# EAGLE schematic Schem (EAGLE 6.2)
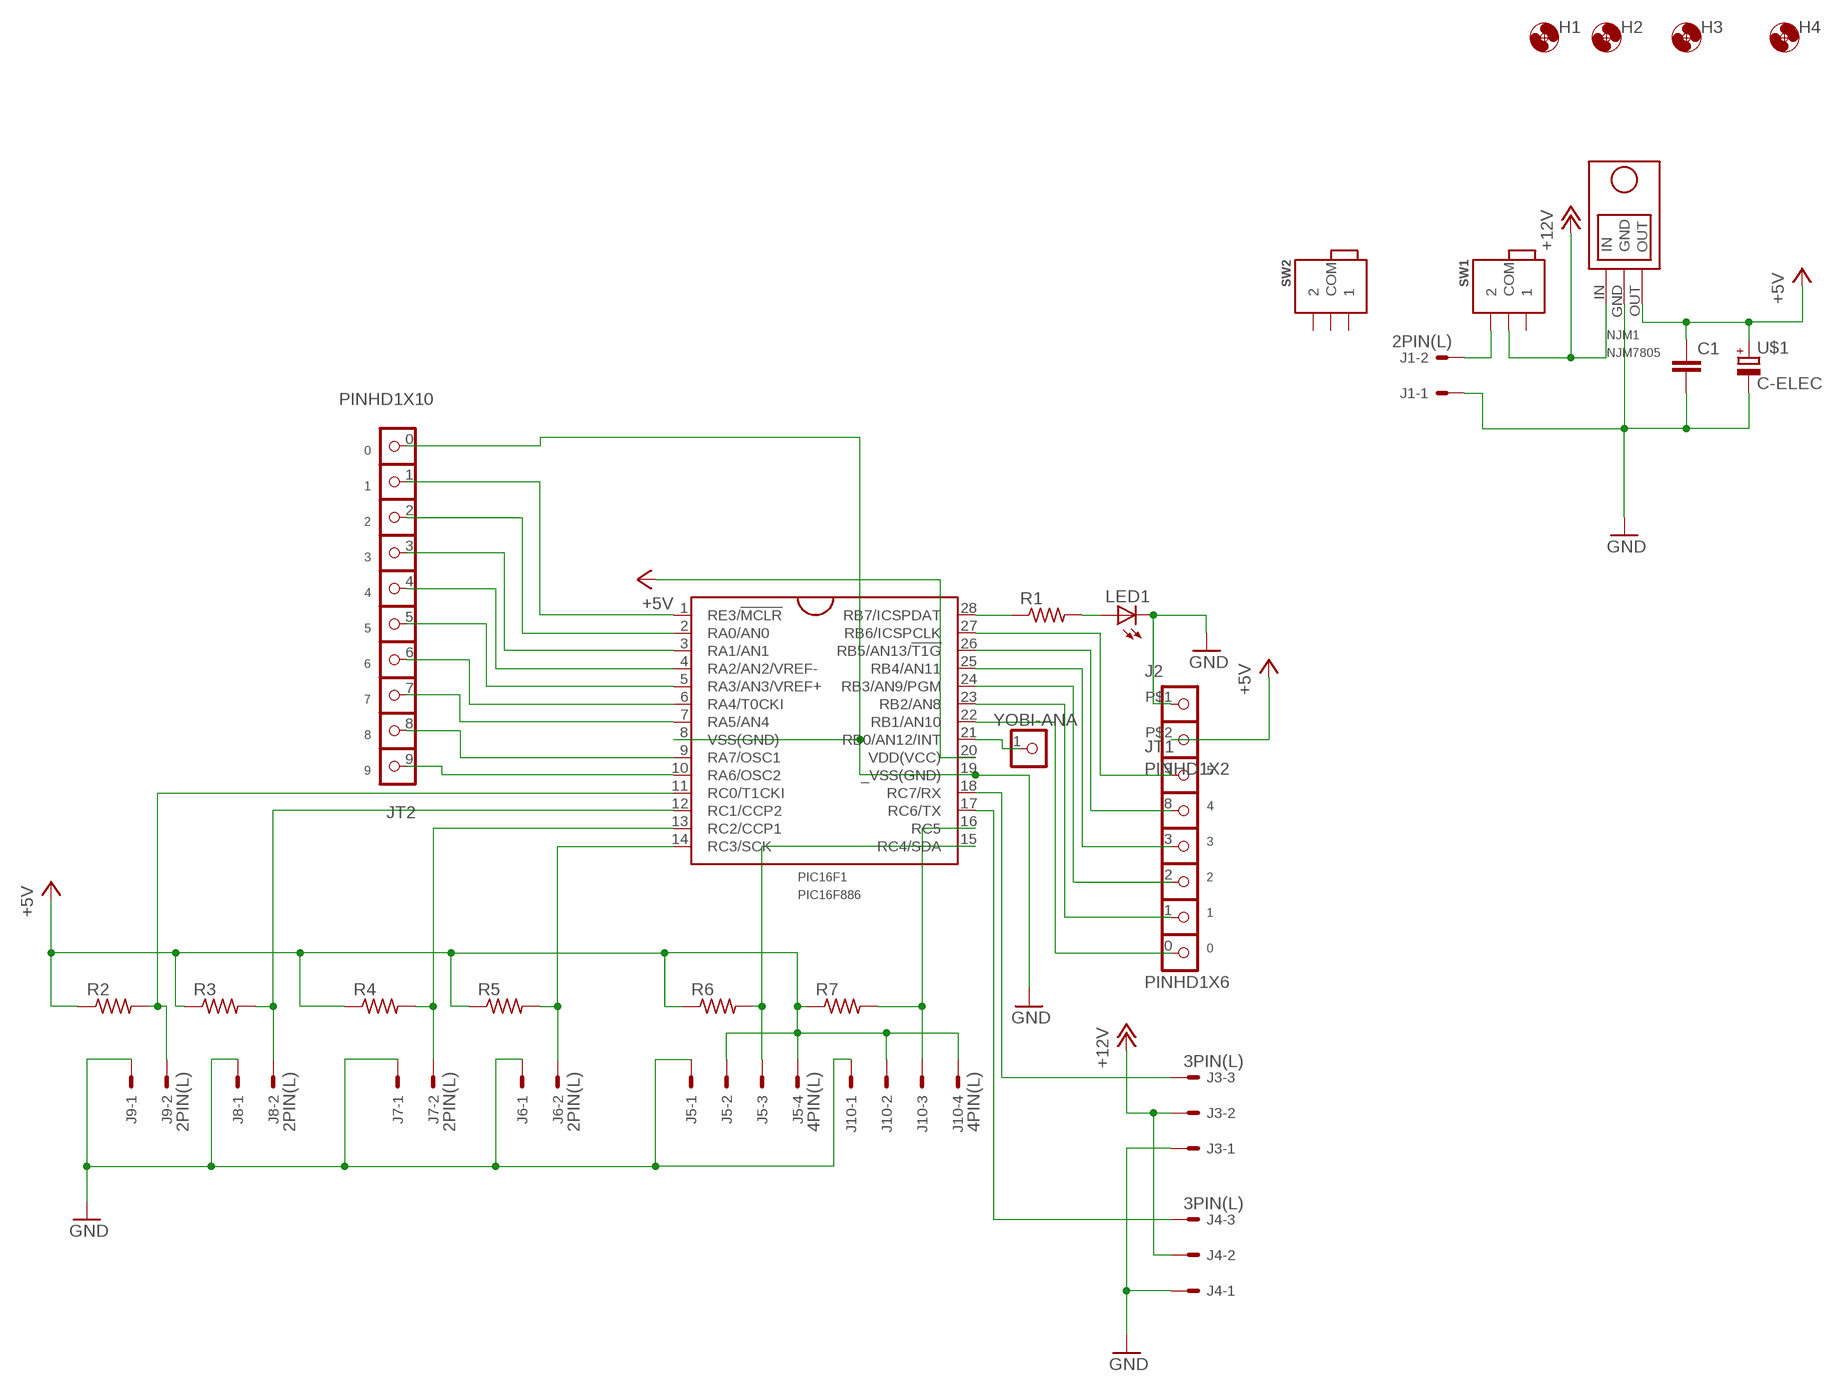
[diagram p0: schematic, sheet 1]

## Parts
C1  C-  [C-2.54]
H1  HOLE3.3M3BOLT  [HOLE3.3]
H2  HOLE3.3M3BOLT  [HOLE3.3]
H3  HOLE3.3M3BOLT  [HOLE3.3]
H4  HOLE3.3M3BOLT  [HOLE3.3]
J1  2PIN(L)  [2PL]
J2  PINHD1X2  [PINHD1X2]
J3  3PIN(L)  [3PL]
J4  3PIN(L)  [3PL]
J5  4PIN(L)  [4PL]
J6  2PIN(L)  [2PL]
J7  2PIN(L)  [2PL]
J8  2PIN(L)  [2PL]
J9  2PIN(L)  [2PL]
J10  4PIN(L)  [4PL]
JT1  PINHD1X6  [PINHD1X6]
JT2  PINHD1X10  [PINHD1X10]
LED1  LED  [LED5MM]
NJM1  NJM7805  [NJM7805]
PIC16F1  PIC16F886  [DIL28-3]
R1  R-  [0207/10]
R2  R-  [0207/10]
R3  R-  [0207/10]
R4  R-  [0207/10]
R5  R-  [0207/10]
R6  R-  [0207/10]
R7  R-  [0207/10]
SW1  SWITCH_MINI  [SWITCH_MINI]
SW2  SWITCH_MINI  [SWITCH_MINI]
U$1  C-ELEC  [C-6MM]
YOBI-ANA  PINHD-1X1SMALL  [1X01_SMALL]

## Nets
+5V: C1.P$1 J2.P$2 J5.2 J5.4 J10.2 J10.4 NJM1.OUT PIC16F1.20(VDD(VCC)) R2.1 R3.1 R4.1 R5.1 R6.1 R7.1 U$1.+
+12V: J3.2 J4.2 NJM1.IN SW1.COM
GND: C1.P$2 J1.1 J2.P$1 J3.1 J4.1 J5.1 J6.1 J7.1 J8.1 J9.1 J10.1 JT2.0 LED1.K(C) NJM1.GND PIC16F1.8(VSS(GND)) PIC16F1.19(_VSS(GND)) U$1.-
N$1: JT1.9 PIC16F1.27(RB6/ICSPCLK)
N$2: JT1.8 PIC16F1.26(RB5/AN13/!T1G)
N$3: JT1.3 PIC16F1.25(RB4/AN11)
N$4: JT1.2 PIC16F1.24(RB3/AN9/PGM)
N$5: JT1.1 PIC16F1.23(RB2/AN8)
N$6: PIC16F1.28(RB7/ICSPDAT) R1.1
N$7: LED1.A R1.2
N$8: JT1.0 PIC16F1.22(RB1/AN10)
N$9: J4.3 PIC16F1.17(RC6/TX)
N$10: J3.3 PIC16F1.18(RC7/RX)
N$11: J9.2 PIC16F1.11(RC0/T1CKI) R2.2
N$12: J1.2 SW1.2
N$13: J7.2 PIC16F1.13(RC2/CCP1) R4.2
N$14: J6.2 PIC16F1.14(RC3/SCK) R5.2
N$15: J8.2 PIC16F1.12(RC1/CCP2) R3.2
N$16: J5.3 PIC16F1.15(RC4/SDA) R6.2
N$17: PIC16F1.21(RB0/AN12/INT) YOBI-ANA.1
N$19: JT2.9 PIC16F1.10(RA6/OSC2)
N$20: JT2.8 PIC16F1.9(RA7/OSC1)
N$21: JT2.7 PIC16F1.7(RA5/AN4)
N$22: JT2.6 PIC16F1.6(RA4/T0CKI)
N$23: JT2.5 PIC16F1.5(RA3/AN3/VREF+)
N$24: JT2.4 PIC16F1.4(RA2/AN2/VREF-)
N$25: JT2.3 PIC16F1.3(RA1/AN1)
N$26: JT2.2 PIC16F1.2(RA0/AN0)
N$27: JT2.1 PIC16F1.1(RE3/!MCLR)
N$28: J10.3 PIC16F1.16(RC5) R7.2
Unconnected: SW1.1 SW2.1 SW2.2 SW2.COM

## Library data of the parts
C1 = My_rcl:C-
H1-H4 = FP-21T for MITS:HOLE3.3
J1 J6-J9 = my_connector:2PIN(L)
J2 = FP-21T for MITS:PINHD1X2
J3 J4 = my_connector:3PIN(L)
J5 J10 = my_connector:4PIN(L)
JT1 = FP-21T for MITS:PINHD1X6
JT2 = FP-21T for MITS:PINHD1X10
LED1 = my_led:LED: LED
NJM1 = My_NJM7805:NJM7805
PIC16F1 = FixLib:PIC16F886
R1-R7 = My_rcl:R-: Resistor
SW1 SW2 = FP-21T for MITS:SWITCH_MINI: Switch 5.08mm
U$1 = My_rcl:C-ELEC
YOBI-ANA = FP-21T for MITS:PINHD-1X1: PIN HEADER